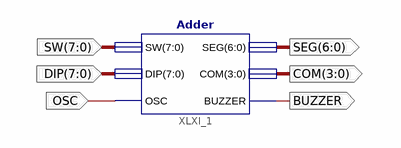
[diagram p0: schematic sheet 1]
// Xilinx ISE schematic main.sch (spartan6) as structural Verilog: 1 symbols, 6 ports
module main (
  input  [7:0] SW,
  input  [7:0] DIP,
  input  OSC,
  output [3:0] COM,
  output [6:0] SEG,
  output BUZZER
);

  Adder XLXI_1 (.SW(SW), .DIP(DIP), .OSC(OSC), .SEG(SEG), .COM(COM), .BUZZER(BUZZER));

  // Notes on the sheet:
  //   LOC on signal SW(7:0) = P55,P56,P57,P58,P59,P61,P62,P66
  //   LOC on signal DIP(7:0) = P99,P100,P101,P102,P104,P105,P111,P112
  //   LOC on signal OSC = P123
  //   LOC on signal COM(3:0) = P30,P33,P43,P44
  //   LOC on signal SEG(6:0) = P27,P29,P32,P34,P35,P40,P41
  //   LOC on signal BUZZER = P83
endmodule
